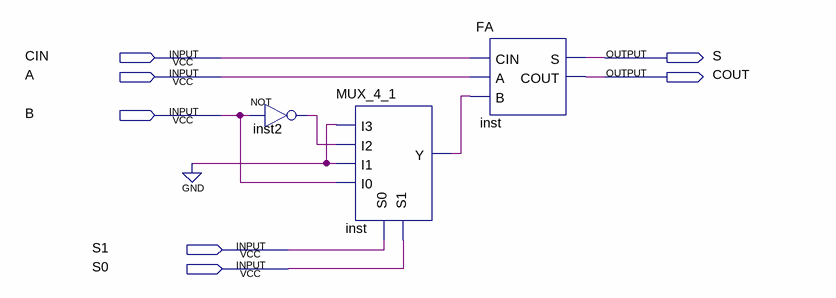
[diagram p0: schematic sheet]
// Quartus schematic FAS.bdf as structural Verilog: 3 symbols, 7 pins
module FAS (
  input  CIN,
  input  A,
  input  B,
  input  S1,
  input  S0,
  output S,
  output COUT
);

  wire inst2_out, inst_y;

  not inst2 (inst2_out, B);
  MUX_4_1 inst (.S1(S0), .S0(S1), .I3(1'b0), .I2(inst2_out), .I1(1'b0), .I0(B), .Y(inst_y));
  FA inst_dup2 (.A(A), .B(inst_y), .CIN(CIN), .S(S), .COUT(COUT));
endmodule
